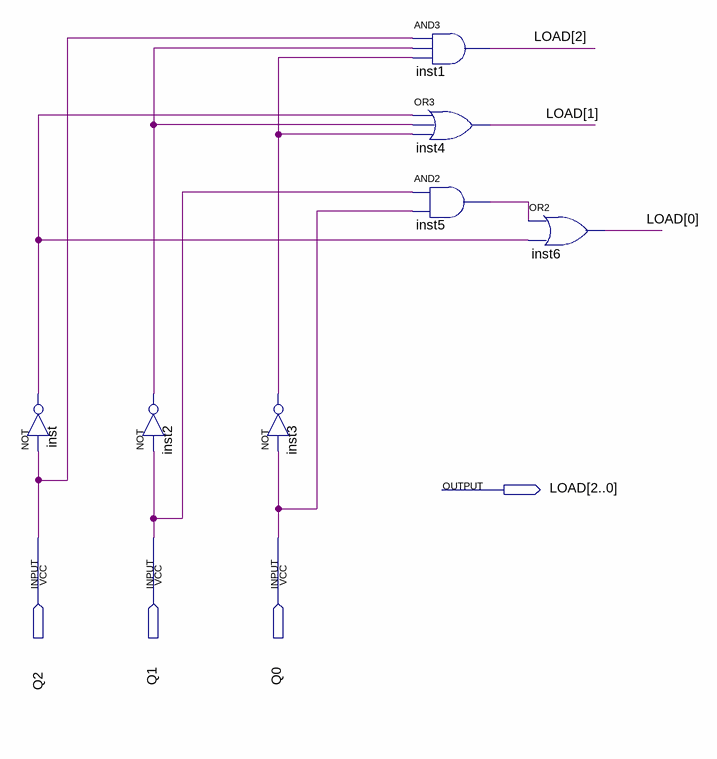
[diagram p0: schematic sheet]
// Quartus schematic LOAD_C3.bdf as structural Verilog: 7 symbols, 4 pins
module LOAD_C3 (
  input  Q2,
  input  Q1,
  input  Q0,
  output [2:0] LOAD
);

  wire inst2_out, inst3_out, inst5_out, inst_out;

  not inst (inst_out, Q2);
  not inst2 (inst2_out, Q1);
  not inst3 (inst3_out, Q0);
  and inst1 (LOAD[2], Q2, inst2_out, inst3_out);
  or inst4 (LOAD[1], inst_out, inst2_out, inst3_out);
  and inst5 (inst5_out, Q1, Q0);
  or inst6 (LOAD[0], inst5_out, inst_out);
endmodule
